# EAGLE design Active_comm_control_1_0 (EAGLE 6.6.0)
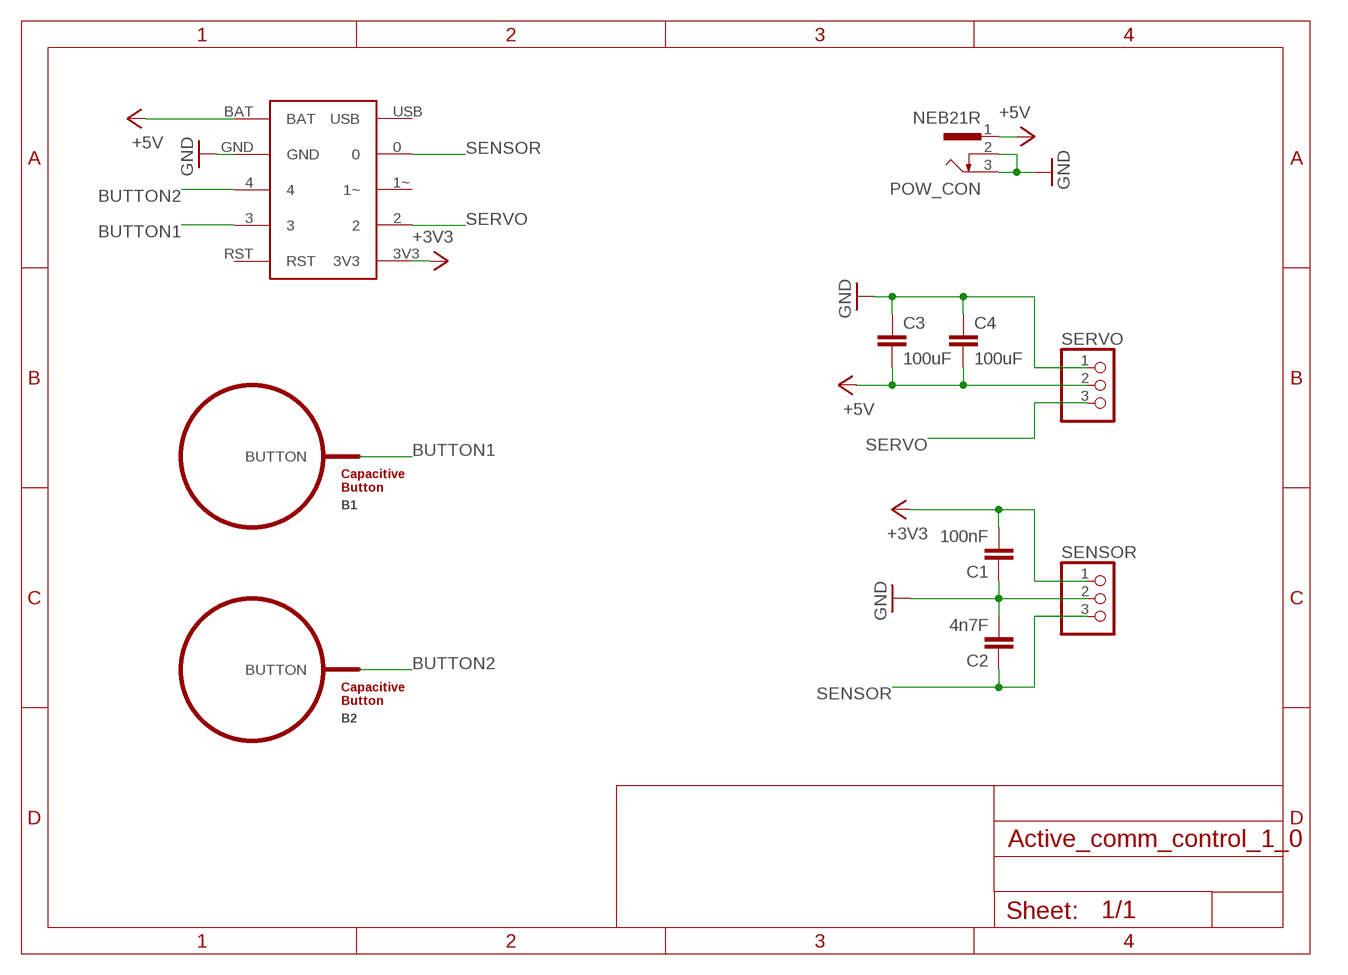
[diagram p0: schematic, sheet 1]

## Parts
B1  BUTTON_PASSIVE10MM  [BUTTON_PASSIVE_10MM]
B2  BUTTON_PASSIVE10MM  [BUTTON_PASSIVE_10MM]
C1  100nF  C-EUC0805  [C0805]
C2  4n7F  C-EUC0805  [C0805]
C3  100uF  C-EUC1206  [C1206]
C4  100uF  C-EUC1206  [C1206]
POW_CON  NEB21R  [NEB21R]
SENSOR  PINHD-1X3  [1X03]
SERVO  PINHD-1X3  [1X03]
TRINKET-M0  TRINKET-M0  [TRINKET-M0-NO-HOLES]

## Nets
+3V3: C1.2 SENSOR.1 TRINKET-M0.3V3
+5V: C3.2 C4.2 POW_CON.1 SERVO.2 TRINKET-M0.BAT
BUTTON1: B1.BUTTON TRINKET-M0.3
BUTTON2: B2.BUTTON TRINKET-M0.4
GND: C1.1 C2.2 C3.1 C4.1 POW_CON.2 POW_CON.3 SENSOR.2 SERVO.1 TRINKET-M0.GND
SENSOR: C2.1 SENSOR.3 TRINKET-M0.0
SERVO: SERVO.3 TRINKET-M0.2
Unconnected: TRINKET-M0.1~ TRINKET-M0.RST TRINKET-M0.USB

## Library data of the parts
B1 B2 = TouchWidgets:BUTTON_PASSIVE: Button, Passive Capacitive/Touch Sensing Type Source : http://www.PatternAgents.com Github : https://github.com/PatternAgents License : http://creativecommons.org/licenses/by-sa/3.1/ (Creative Commons 3.1) THIS SOFTWARE IS PROVIDED BY THE CONTRIBUTORS "AS IS" AND WITHOUT ANY EXPRESS OR IMPLIED WARRANTIES, INCLUDING, BUT NOT LIMITED TO, THE IMPLIED WARRANTIES OF MERCHANTABILITY AND FITNESS FOR A PARTICULAR PURPOSE ARE DISCLAIMED. IN NO EVENT SHALL THE COPYRIGHT OWNER OR CONTRIBUTORS BE LIABLE FOR ANY DIRECT, INDIRECT, INCIDENTAL, SPECIAL, EXEMPLARY, OR CONSEQUENTIAL DAMAGES (INCLUDING, BUT NOT LIMITED TO, PROCUREMENT OF SUBSTITUTE GOODS OR SERVICES; LOSS OF USE, DATA, OR PROFITS; OR BUSINESS INTERRUPTION) HOWEVER CAUSED AND ON ANY THEORY OF LIABILITY, WHETHER IN CONTRACT, STRICT LIABILITY, OR TORT (INCLUDING NEGLIGENCE OR OTHERWISE) ARISING IN ANY WAY OUT OF THE USE OF THIS SOFTWARE, EVEN IF ADVISED OF THE POSSIBILITY OF SUCH DAMAGE.
C1 C2 = resistor:C-EU: CAPACITOR, European symbol
C3 C4 = rcl:C-EU: CAPACITOR, European symbol
POW_CON = con-lumberg:NEB21R: Netzgeräte-Einbaukupplung abgewinkelte Ausführung mit Öffner Source: http://www.lumberg.com/Produkte/PDFs/NEB21R.pdf; MPN: NEB 21 R; OC_FARNELL: 1217037; OC_NEWARK: 97K6458
SENSOR SERVO = adafruit:PINHD-1X3: PIN HEADER
TRINKET-M0 = adafruit:TRINKET-M0

## Board
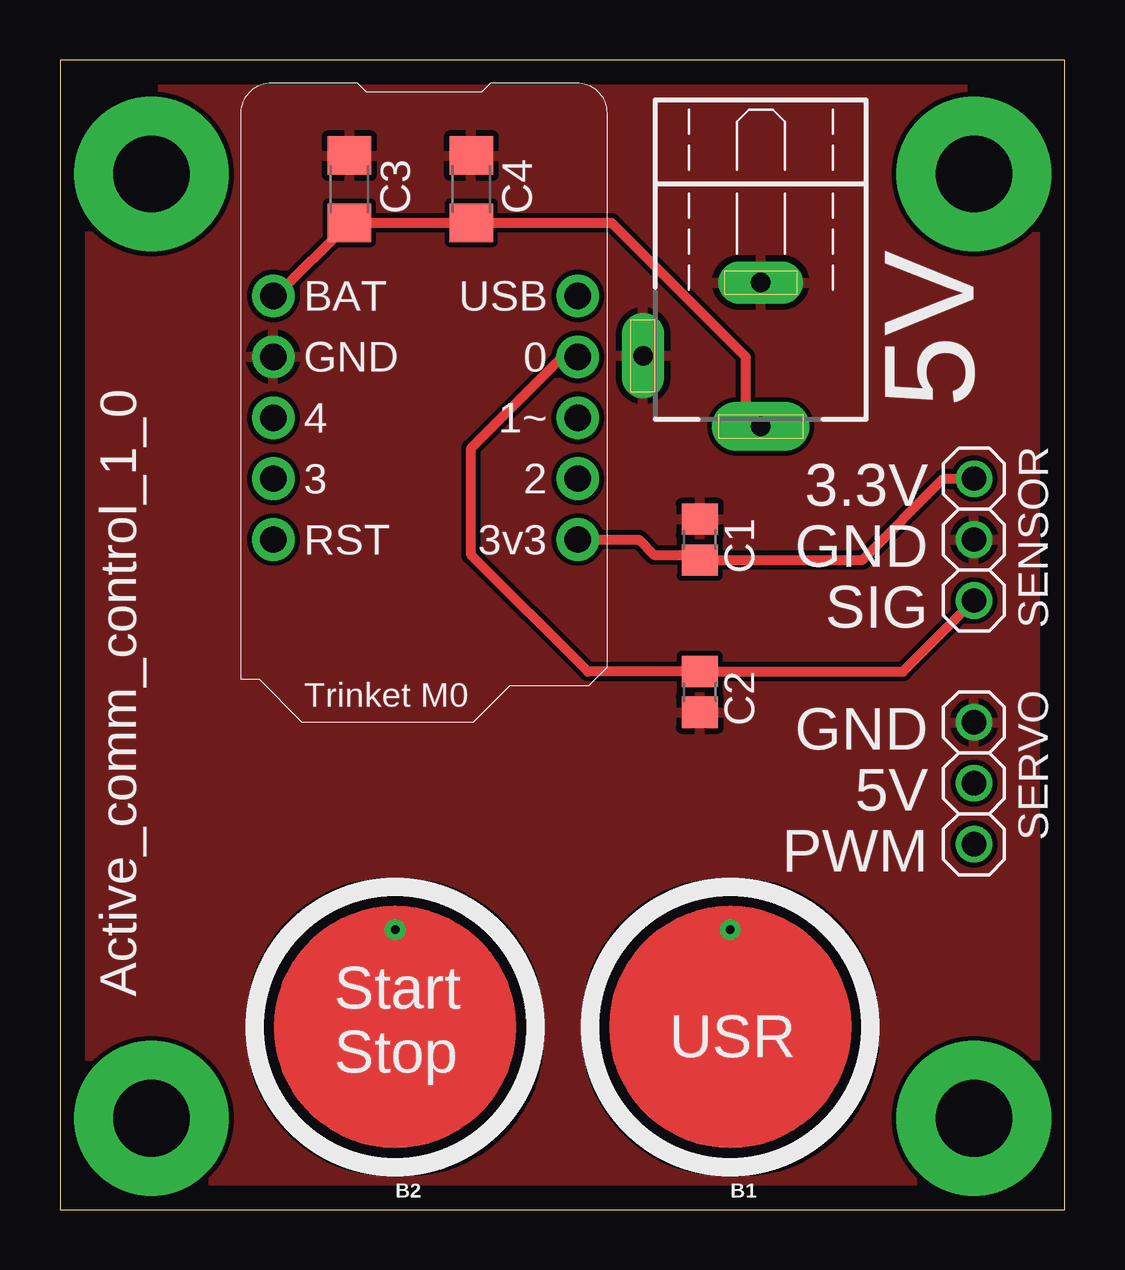
[diagram p1: board, top side]
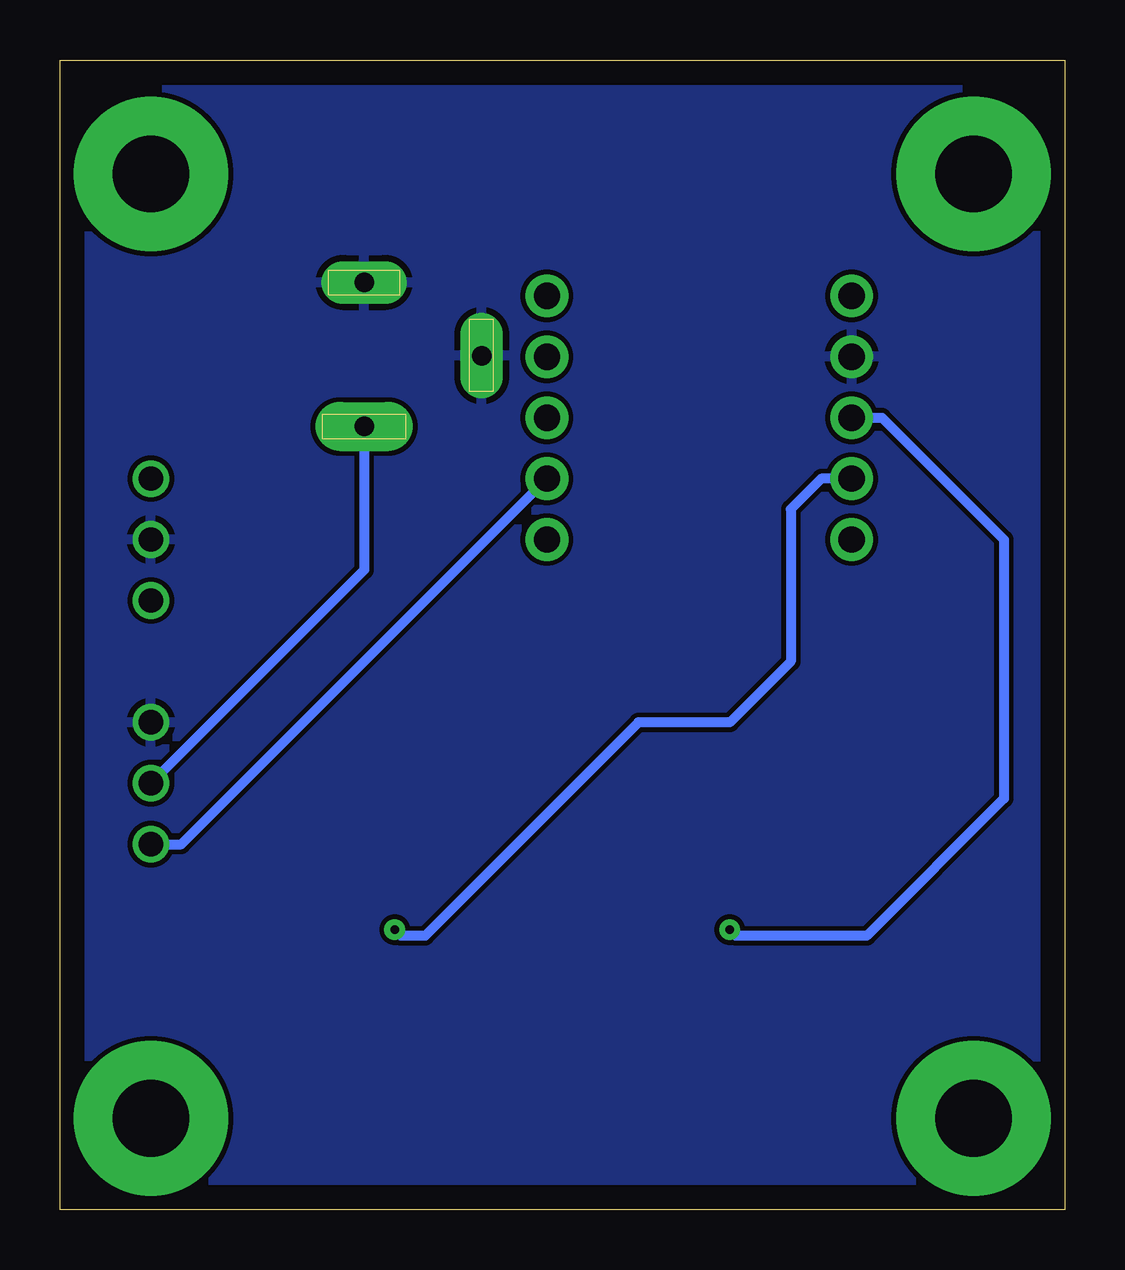
[diagram p2: board, bottom side, seen from below]

Size 41.89 x 47.93 mm. Coordinates in mm from the lower left corner, seen from the top.
Outline: 0,0 41.89,0 41.89,47.93 0,47.93 0,0
Copper layers (1*16): Top 0.035mm / dielectric 1.5mm / Bottom 0.035mm
Design rules "default": minimum track width 10mil, minimum drill 24mil, track to track 8mil, track to pad 8mil, pad to pad 8mil, via to via 8mil, smd to smd 8mil, copper to edge 40mil, drill to drill 8mil, minimum pad ring 10mil, minimum via ring 8mil, stop-mask expansion 4mil, vias tented up to drill 0mil, thermal gap 10mil

### Footprints (pad centres in the part's own frame; a part is rotated, then mirrored left to right if it is on the bottom)
BUTTON_PASSIVE_10MM = drill 0.356: BUTTON 0,4.064
C0805 = smd 1.3 x 1.5: 1 -0.85,0; 2 0.85,0
C1206 = smd 1.6 x 1.8: 1 -1.4,0; 2 1.4,0
NEB21R = drill 0.813 pad 2.032 long: 1 0,7.35 | drill 0.813 pad 1.778 long: 2 4.9,4.4; 3 0,1.35
1X03 = drill 1.016: 1 -2.54,0; 2 0,0; 3 2.54,0
TRINKET-M0-NO-HOLES = drill 1.1 pad 1.778: 0 6.35,2.54; 1~ 6.35,0; 2 6.35,-2.54; 3 -6.35,-2.54; 3V3 6.35,-5.08; 4 -6.35,0; BAT -6.35,5.08; GND -6.35,2.54; RST -6.35,-5.08; USB 6.35,5.08

### Placement (x,y rotation side)
B1  27.94,7.62 0 top
B2  13.97,7.62 0 top
C1  26.67,27.94 270 top
C2  26.67,21.59 270 top
C3  12.06,42.55 270 top
C4  17.14,42.55 270 top
POW_CON  29.21,40.01 180 top
SENSOR  38.1,27.94 270 top
SERVO  38.1,17.78 270 top
TRINKET-M0  15.24,33.02 0 top

### Tracks (layer width: path | path; a pad name or v marks a point on that pad's centre or on a via)
+3V3
  Top 0.406: TRINKET-M0.3V3 24.13,27.94 24.77,27.3 26.45,27.3 C1.2 33.44,27.09 36.83,30.48 SENSOR.1
+5V
  Top 0.406: TRINKET-M0.BAT 9.02,38.1 C3.2 C4.2 22.99,41.15 28.57,35.56 28.57,33.29 POW_CON.1
  Bottom 0.406: POW_CON.1 29.21,26.67 SERVO.2
BUTTON1
  Bottom 0.406: TRINKET-M0.3 10.16,30.48 11.43,29.21 11.43,22.86 13.97,20.32 17.78,20.32 26.67,11.43 27.69,11.43 B1.BUTTON
BUTTON2
  Bottom 0.406: TRINKET-M0.4 7.62,33.02 2.54,27.94 2.54,17.14 8.26,11.43 13.72,11.43 B2.BUTTON
GND
  pour Bottom: 0,48.26 0,0 41.91,0 41.91,48.26
  pour Top: 0,48.26 0,0 41.91,0 41.91,48.26
N$1  (via drill 3.2 pad 6.45)
  other vias: 38.1,3.81
N$2  (via drill 3.2 pad 6.45)
  other vias: 38.1,43.18
N$3  (via drill 3.2 pad 6.45)
  other vias: 3.81,43.18
N$4  (via drill 3.2 pad 6.45)
  other vias: 3.81,3.81
SENSOR
  Top 0.406: SENSOR.3 35.14,22.44 C2.1 22.01,22.44 17.14,27.3 17.14,31.75 20.95,35.56 TRINKET-M0.0
SERVO
  Bottom 0.406: SERVO.3 36.83,15.24 TRINKET-M0.2

### Text on the board
tPlace: 5V | 3.3V | GND | SIG | GND | 5V | PWM | Active_comm_control_1_0 | Start / Stop | USR